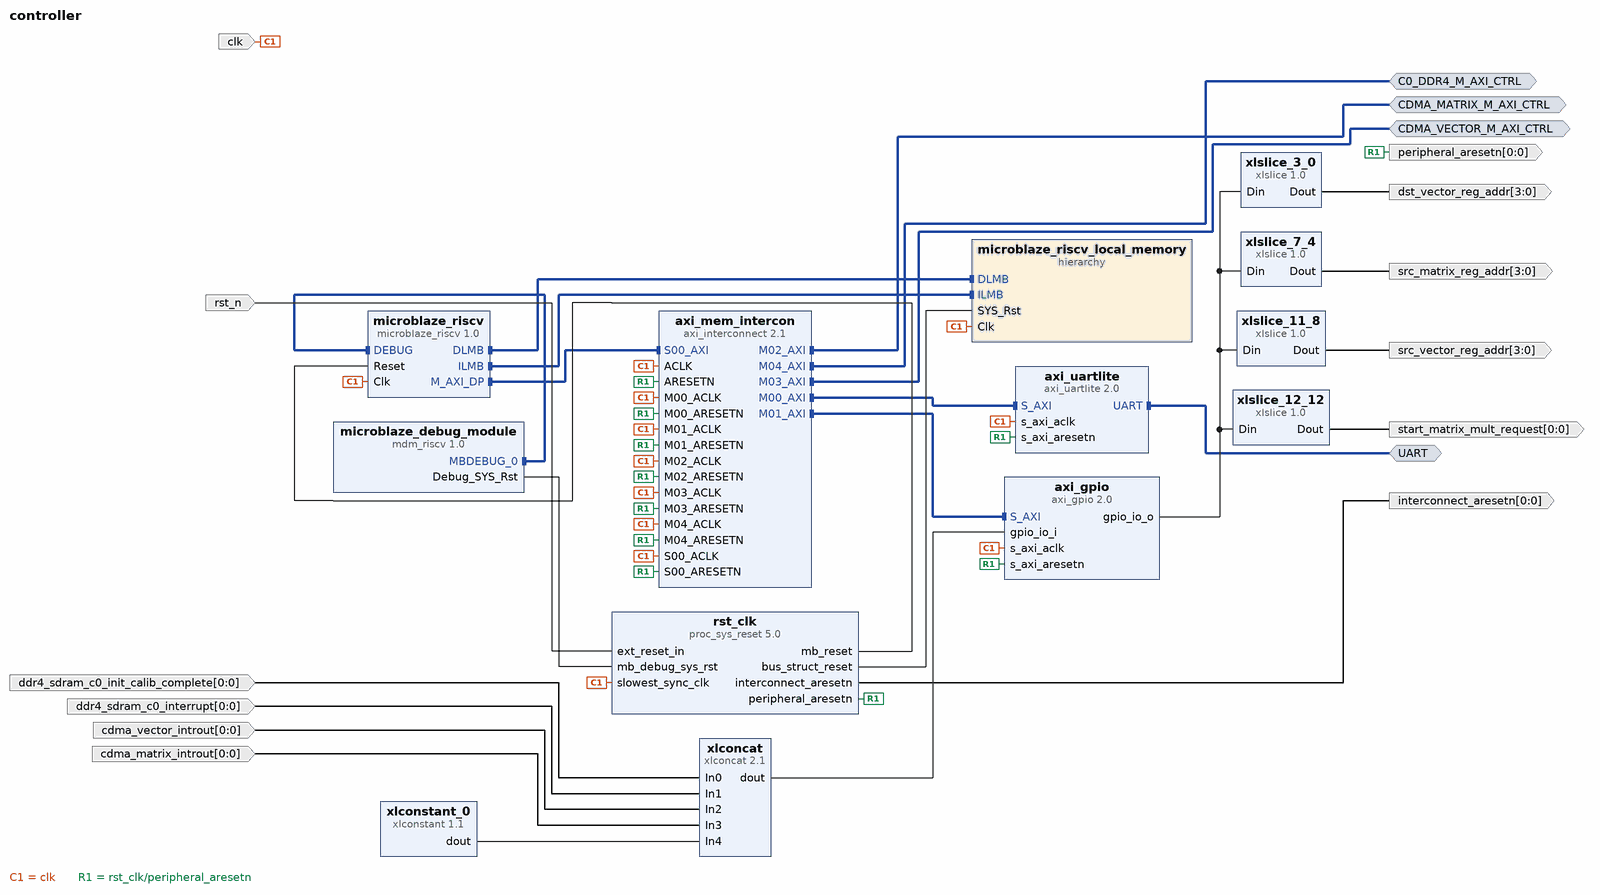
[diagram p0: block diagram of the top level]
# Vivado block design controller, xcu250-figd2104-2L-e, Vivado 2024.1
create_bd_design controller

create_bd_intf_port -mode Master -vlnv xilinx.com:interface:uart_rtl:1.0 UART
create_bd_intf_port -mode Master -vlnv xilinx.com:interface:aximm_rtl:1.0 CDMA_VECTOR_M_AXI_CTRL
set_property -dict [list \
  CONFIG.ADDR_WIDTH 32 \
  CONFIG.DATA_WIDTH 32 \
  CONFIG.HAS_BURST 0 \
  CONFIG.HAS_CACHE 0 \
  CONFIG.HAS_LOCK 0 \
  CONFIG.HAS_QOS 0 \
  CONFIG.HAS_REGION 0 \
  CONFIG.PROTOCOL AXI4LITE \
] [get_bd_intf_ports CDMA_VECTOR_M_AXI_CTRL]
create_bd_intf_port -mode Master -vlnv xilinx.com:interface:aximm_rtl:1.0 CDMA_MATRIX_M_AXI_CTRL
set_property -dict [list \
  CONFIG.ADDR_WIDTH 32 \
  CONFIG.DATA_WIDTH 32 \
  CONFIG.HAS_BURST 0 \
  CONFIG.HAS_CACHE 0 \
  CONFIG.HAS_LOCK 0 \
  CONFIG.HAS_QOS 0 \
  CONFIG.HAS_REGION 0 \
  CONFIG.NUM_READ_OUTSTANDING 2 \
  CONFIG.NUM_WRITE_OUTSTANDING 2 \
  CONFIG.PROTOCOL AXI4LITE \
] [get_bd_intf_ports CDMA_MATRIX_M_AXI_CTRL]
create_bd_intf_port -mode Master -vlnv xilinx.com:interface:aximm_rtl:1.0 C0_DDR4_M_AXI_CTRL
set_property -dict [list \
  CONFIG.ADDR_WIDTH 32 \
  CONFIG.DATA_WIDTH 32 \
  CONFIG.FREQ_HZ 300000000 \
  CONFIG.HAS_BURST 0 \
  CONFIG.HAS_CACHE 0 \
  CONFIG.HAS_LOCK 0 \
  CONFIG.HAS_QOS 0 \
  CONFIG.HAS_REGION 0 \
  CONFIG.PROTOCOL AXI4LITE \
] [get_bd_intf_ports C0_DDR4_M_AXI_CTRL]
create_bd_port -dir I -type clk clk
set_property -dict [list \
  CONFIG.ASSOCIATED_BUSIF C0_DDR4_M_AXI_CTRL:CDMA_VECTOR_M_AXI_CTRL:CDMA_MATRIX_M_AXI_CTRL \
  CONFIG.ASSOCIATED_RESET rst_n:peripheral_aresetn:interconnect_aresetn \
  CONFIG.FREQ_HZ 300000000 \
] [get_bd_ports clk]
create_bd_port -dir I -type rst rst_n
set_property -dict {CONFIG.POLARITY ACTIVE_LOW} [get_bd_ports rst_n]
create_bd_port -dir O -from 0 -to 0 -type rst peripheral_aresetn
create_bd_port -dir O -from 0 -to 0 -type rst interconnect_aresetn
create_bd_port -dir O -from 0 -to 0 start_matrix_mult_request
create_bd_port -dir O -from 3 -to 0 src_vector_reg_addr
create_bd_port -dir O -from 3 -to 0 src_matrix_reg_addr
create_bd_port -dir O -from 3 -to 0 dst_vector_reg_addr
create_bd_port -dir I -from 0 -to 0 ddr4_sdram_c0_init_calib_complete
create_bd_port -dir I -from 0 -to 0 ddr4_sdram_c0_interrupt
create_bd_port -dir I -from 0 -to 0 cdma_vector_introut
create_bd_port -dir I -from 0 -to 0 cdma_matrix_introut

create_bd_cell -type ip -vlnv xilinx.com:ip:microblaze_riscv:1.0 microblaze_riscv
set_property -dict [list \
  CONFIG.C_DEBUG_ENABLED 1 \
  CONFIG.C_D_AXI 1 \
  CONFIG.C_D_LMB 1 \
  CONFIG.C_I_LMB 1 \
  CONFIG.C_M_AXI_D_BUS_EXCEPTION 1 \
  CONFIG.C_NUMBER_OF_PC_BRK 8 \
  CONFIG.C_NUMBER_OF_RD_ADDR_BRK 4 \
  CONFIG.C_NUMBER_OF_WR_ADDR_BRK 4 \
  CONFIG.C_USE_COMPRESSION 1 \
  CONFIG.G_TEMPLATE_LIST 1 \
] [get_bd_cells microblaze_riscv]
create_bd_cell -type hier microblaze_riscv_local_memory
create_bd_cell -type ip -vlnv xilinx.com:ip:mdm_riscv:1.0 microblaze_debug_module
create_bd_cell -type ip -vlnv xilinx.com:ip:proc_sys_reset:5.0 rst_clk
set_property -dict {CONFIG.RESET_BOARD_INTERFACE resetn CONFIG.USE_BOARD_FLOW true} [get_bd_cells rst_clk]
create_bd_cell -type ip -vlnv xilinx.com:ip:axi_gpio:2.0 axi_gpio
set_property -dict [list \
  CONFIG.C_ALL_INPUTS 0 \
  CONFIG.C_ALL_OUTPUTS 0 \
  CONFIG.C_GPIO_WIDTH 13 \
  CONFIG.C_INTERRUPT_PRESENT 0 \
  CONFIG.C_IS_DUAL 0 \
  CONFIG.GPIO_BOARD_INTERFACE Custom \
  CONFIG.USE_BOARD_FLOW true \
] [get_bd_cells axi_gpio]
create_bd_cell -type ip -vlnv xilinx.com:ip:axi_uartlite:2.0 axi_uartlite
set_property -dict [list \
  CONFIG.C_BAUDRATE 115200 \
  CONFIG.C_S_AXI_ACLK_FREQ_HZ_d 300 \
  CONFIG.UARTLITE_BOARD_INTERFACE rs232_uart \
  CONFIG.USE_BOARD_FLOW true \
] [get_bd_cells axi_uartlite]
create_bd_cell -type ip -vlnv xilinx.com:ip:axi_interconnect:2.1 axi_mem_intercon
set_property -dict {CONFIG.NUM_MI 5 CONFIG.STRATEGY 0} [get_bd_cells axi_mem_intercon]
create_bd_cell -type ip -vlnv xilinx.com:ip:xlslice:1.0 xlslice_12_12
set_property -dict {CONFIG.DIN_FROM 12 CONFIG.DIN_TO 12 CONFIG.DIN_WIDTH 13} [get_bd_cells xlslice_12_12]
create_bd_cell -type ip -vlnv xilinx.com:ip:xlslice:1.0 xlslice_11_8
set_property -dict {CONFIG.DIN_FROM 11 CONFIG.DIN_TO 8 CONFIG.DIN_WIDTH 13} [get_bd_cells xlslice_11_8]
create_bd_cell -type ip -vlnv xilinx.com:ip:xlslice:1.0 xlslice_3_0
set_property -dict {CONFIG.DIN_FROM 3 CONFIG.DIN_WIDTH 13} [get_bd_cells xlslice_3_0]
create_bd_cell -type ip -vlnv xilinx.com:ip:xlslice:1.0 xlslice_7_4
set_property -dict {CONFIG.DIN_FROM 7 CONFIG.DIN_TO 4 CONFIG.DIN_WIDTH 13} [get_bd_cells xlslice_7_4]
create_bd_cell -type ip -vlnv xilinx.com:ip:xlconcat:2.1 xlconcat
set_property -dict {CONFIG.IN4_WIDTH 9 CONFIG.NUM_PORTS 5} [get_bd_cells xlconcat]
create_bd_cell -type ip -vlnv xilinx.com:ip:xlconstant:1.1 xlconstant_0
set_property -dict {CONFIG.CONST_VAL 0 CONFIG.CONST_WIDTH 9} [get_bd_cells xlconstant_0]

# ---- hierarchy /microblaze_riscv_local_memory ----
current_bd_instance /microblaze_riscv_local_memory
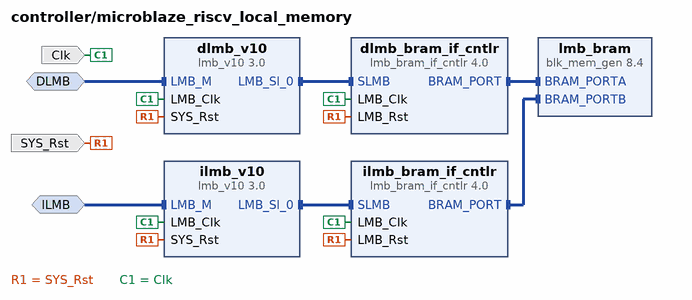
[diagram p1: block diagram inside /microblaze_riscv_local_memory]
create_bd_intf_pin -mode MirroredMaster -vlnv xilinx.com:interface:lmb_rtl:1.0 DLMB
create_bd_intf_pin -mode MirroredMaster -vlnv xilinx.com:interface:lmb_rtl:1.0 ILMB
create_bd_pin -dir I -type clk Clk
create_bd_pin -dir I -type rst SYS_Rst

create_bd_cell -type ip -vlnv xilinx.com:ip:lmb_v10:3.0 dlmb_v10
create_bd_cell -type ip -vlnv xilinx.com:ip:lmb_v10:3.0 ilmb_v10
create_bd_cell -type ip -vlnv xilinx.com:ip:lmb_bram_if_cntlr:4.0 dlmb_bram_if_cntlr
set_property -dict {CONFIG.C_ECC 0} [get_bd_cells dlmb_bram_if_cntlr]
create_bd_cell -type ip -vlnv xilinx.com:ip:lmb_bram_if_cntlr:4.0 ilmb_bram_if_cntlr
set_property -dict {CONFIG.C_ECC 0} [get_bd_cells ilmb_bram_if_cntlr]
create_bd_cell -type ip -vlnv xilinx.com:ip:blk_mem_gen:8.4 lmb_bram
set_property -dict {CONFIG.Memory_Type True_Dual_Port_RAM CONFIG.use_bram_block BRAM_Controller} [get_bd_cells lmb_bram]

# ---- connections ----

current_bd_instance /microblaze_riscv_local_memory
connect_bd_intf_net -intf_net microblaze_riscv_0_dlmb [get_bd_intf_pins dlmb_v10/LMB_M] [get_bd_intf_pins DLMB]
connect_bd_intf_net -intf_net microblaze_riscv_0_dlmb_bus [get_bd_intf_pins dlmb_v10/LMB_Sl_0] [get_bd_intf_pins dlmb_bram_if_cntlr/SLMB]
connect_bd_intf_net -intf_net microblaze_riscv_0_dlmb_cntlr [get_bd_intf_pins dlmb_bram_if_cntlr/BRAM_PORT] [get_bd_intf_pins lmb_bram/BRAM_PORTA]
connect_bd_intf_net -intf_net microblaze_riscv_0_ilmb [get_bd_intf_pins ilmb_v10/LMB_M] [get_bd_intf_pins ILMB]
connect_bd_intf_net -intf_net microblaze_riscv_0_ilmb_bus [get_bd_intf_pins ilmb_v10/LMB_Sl_0] [get_bd_intf_pins ilmb_bram_if_cntlr/SLMB]
connect_bd_intf_net -intf_net microblaze_riscv_0_ilmb_cntlr [get_bd_intf_pins ilmb_bram_if_cntlr/BRAM_PORT] [get_bd_intf_pins lmb_bram/BRAM_PORTB]
connect_bd_net [get_bd_pins SYS_Rst] \
  [get_bd_pins dlmb_v10/SYS_Rst] [get_bd_pins dlmb_bram_if_cntlr/LMB_Rst] [get_bd_pins ilmb_v10/SYS_Rst] \
  [get_bd_pins ilmb_bram_if_cntlr/LMB_Rst]
connect_bd_net -net microblaze_riscv_0_Clk [get_bd_pins Clk] \
  [get_bd_pins dlmb_v10/LMB_Clk] [get_bd_pins dlmb_bram_if_cntlr/LMB_Clk] [get_bd_pins ilmb_v10/LMB_Clk] \
  [get_bd_pins ilmb_bram_if_cntlr/LMB_Clk]
set_property HDL_ATTRIBUTE.BMM_INFO_ADDRESS_SPACE {byte  0x00000000 32 > controller microblaze_riscv_local_memory/lmb_bram} [get_bd_cells dlmb_bram_if_cntlr]
set_property HDL_ATTRIBUTE.KEEP_HIERARCHY yes [get_bd_cells dlmb_bram_if_cntlr]

current_bd_instance /
connect_bd_intf_net [get_bd_intf_pins axi_mem_intercon/M00_AXI] [get_bd_intf_pins axi_uartlite/S_AXI]
connect_bd_intf_net [get_bd_intf_pins axi_mem_intercon/M01_AXI] [get_bd_intf_pins axi_gpio/S_AXI]
connect_bd_intf_net [get_bd_intf_ports CDMA_MATRIX_M_AXI_CTRL] [get_bd_intf_pins axi_mem_intercon/M02_AXI]
connect_bd_intf_net [get_bd_intf_ports CDMA_VECTOR_M_AXI_CTRL] [get_bd_intf_pins axi_mem_intercon/M03_AXI]
connect_bd_intf_net [get_bd_intf_ports C0_DDR4_M_AXI_CTRL] [get_bd_intf_pins axi_mem_intercon/M04_AXI]
connect_bd_intf_net -intf_net axi_uartlite_0_UART [get_bd_intf_ports UART] [get_bd_intf_pins axi_uartlite/UART]
connect_bd_intf_net -intf_net microblaze_riscv_0_debug [get_bd_intf_pins microblaze_debug_module/MBDEBUG_0] [get_bd_intf_pins microblaze_riscv/DEBUG]
connect_bd_intf_net -intf_net microblaze_riscv_0_dlmb_1 [get_bd_intf_pins microblaze_riscv/DLMB] [get_bd_intf_pins microblaze_riscv_local_memory/DLMB]
connect_bd_intf_net -intf_net microblaze_riscv_0_ilmb_1 [get_bd_intf_pins microblaze_riscv/ILMB] [get_bd_intf_pins microblaze_riscv_local_memory/ILMB]
connect_bd_intf_net [get_bd_intf_pins microblaze_riscv/M_AXI_DP] [get_bd_intf_pins axi_mem_intercon/S00_AXI]
connect_bd_net -net In0_0_1 [get_bd_ports ddr4_sdram_c0_init_calib_complete] [get_bd_pins xlconcat/In0]
connect_bd_net -net In1_0_1 [get_bd_ports ddr4_sdram_c0_interrupt] [get_bd_pins xlconcat/In1]
connect_bd_net -net In2_0_1 [get_bd_ports cdma_vector_introut] [get_bd_pins xlconcat/In2]
connect_bd_net -net In3_0_1 [get_bd_ports cdma_matrix_introut] [get_bd_pins xlconcat/In3]
connect_bd_net -net axi_gpio_0_gpio_io_o [get_bd_pins axi_gpio/gpio_io_o] \
  [get_bd_pins xlslice_3_0/Din] [get_bd_pins xlslice_11_8/Din] [get_bd_pins xlslice_12_12/Din] [get_bd_pins xlslice_7_4/Din]
connect_bd_net -net mdm_1_debug_sys_rst [get_bd_pins microblaze_debug_module/Debug_SYS_Rst] [get_bd_pins rst_clk/mb_debug_sys_rst]
connect_bd_net -net microblaze_riscv_0_Clk [get_bd_ports clk] \
  [get_bd_pins microblaze_riscv/Clk] [get_bd_pins microblaze_riscv_local_memory/Clk] [get_bd_pins rst_clk/slowest_sync_clk] \
  [get_bd_pins axi_mem_intercon/ACLK] [get_bd_pins axi_mem_intercon/S00_ACLK] [get_bd_pins axi_mem_intercon/M00_ACLK] \
  [get_bd_pins axi_gpio/s_axi_aclk] [get_bd_pins axi_mem_intercon/M01_ACLK] [get_bd_pins axi_uartlite/s_axi_aclk] \
  [get_bd_pins axi_mem_intercon/M04_ACLK] [get_bd_pins axi_mem_intercon/M03_ACLK] [get_bd_pins axi_mem_intercon/M02_ACLK]
connect_bd_net -net rst_Clk_100M_bus_struct_reset [get_bd_pins rst_clk/bus_struct_reset] [get_bd_pins microblaze_riscv_local_memory/SYS_Rst]
connect_bd_net -net rst_Clk_100M_mb_reset [get_bd_pins rst_clk/mb_reset] [get_bd_pins microblaze_riscv/Reset]
connect_bd_net [get_bd_pins rst_clk/interconnect_aresetn] [get_bd_ports interconnect_aresetn]
connect_bd_net [get_bd_pins rst_clk/peripheral_aresetn] \
  [get_bd_ports peripheral_aresetn] [get_bd_pins axi_mem_intercon/S00_ARESETN] [get_bd_pins axi_mem_intercon/M00_ARESETN] \
  [get_bd_pins axi_mem_intercon/ARESETN] [get_bd_pins axi_gpio/s_axi_aresetn] [get_bd_pins axi_mem_intercon/M01_ARESETN] \
  [get_bd_pins axi_uartlite/s_axi_aresetn] [get_bd_pins axi_mem_intercon/M02_ARESETN] \
  [get_bd_pins axi_mem_intercon/M04_ARESETN] [get_bd_pins axi_mem_intercon/M03_ARESETN]
connect_bd_net [get_bd_ports rst_n] [get_bd_pins rst_clk/ext_reset_in]
connect_bd_net -net xlconcat_0_dout [get_bd_pins xlconcat/dout] [get_bd_pins axi_gpio/gpio_io_i]
connect_bd_net [get_bd_pins xlconstant_0/dout] [get_bd_pins xlconcat/In4]
connect_bd_net -net xlslice_0_Dout [get_bd_pins xlslice_12_12/Dout] [get_bd_ports start_matrix_mult_request]
connect_bd_net -net xlslice_1_Dout [get_bd_pins xlslice_11_8/Dout] [get_bd_ports src_vector_reg_addr]
connect_bd_net -net xlslice_2_Dout [get_bd_pins xlslice_3_0/Dout] [get_bd_ports dst_vector_reg_addr]
connect_bd_net -net xlslice_3_Dout [get_bd_pins xlslice_7_4/Dout] [get_bd_ports src_matrix_reg_addr]
set_property HDL_ATTRIBUTE.BMM_INFO_PROCESSOR {riscv > controller microblaze_riscv_local_memory/dlmb_bram_if_cntlr} [get_bd_cells microblaze_riscv]
set_property HDL_ATTRIBUTE.KEEP_HIERARCHY yes [get_bd_cells microblaze_riscv]

# ---- address map ----
assign_bd_address -offset 0x00000000 -range 128K -target_address_space [get_bd_addr_spaces microblaze_riscv/Data] [get_bd_addr_segs microblaze_riscv_local_memory/dlmb_bram_if_cntlr/SLMB/Mem]
assign_bd_address -offset 0x40000000 -range 64K -target_address_space [get_bd_addr_spaces microblaze_riscv/Data] [get_bd_addr_segs axi_gpio/S_AXI/Reg]
assign_bd_address -offset 0x40600000 -range 64K -target_address_space [get_bd_addr_spaces microblaze_riscv/Data] [get_bd_addr_segs axi_uartlite/S_AXI/Reg]
assign_bd_address -offset 0x44A00000 -range 64K -target_address_space [get_bd_addr_spaces microblaze_riscv/Data] [get_bd_addr_segs C0_DDR4_M_AXI_CTRL/Reg]
assign_bd_address -offset 0x44A10000 -range 64K -target_address_space [get_bd_addr_spaces microblaze_riscv/Data] [get_bd_addr_segs CDMA_MATRIX_M_AXI_CTRL/Reg]
assign_bd_address -offset 0x44A20000 -range 64K -target_address_space [get_bd_addr_spaces microblaze_riscv/Data] [get_bd_addr_segs CDMA_VECTOR_M_AXI_CTRL/Reg]
assign_bd_address -offset 0x00000000 -range 128K -target_address_space [get_bd_addr_spaces microblaze_riscv/Instruction] [get_bd_addr_segs microblaze_riscv_local_memory/ilmb_bram_if_cntlr/SLMB/Mem]

validate_bd_design
save_bd_design
